# Altium schematic sheet IQ_Mod.SchDoc
size B; SheetNumber: 2; SheetTotal: 15
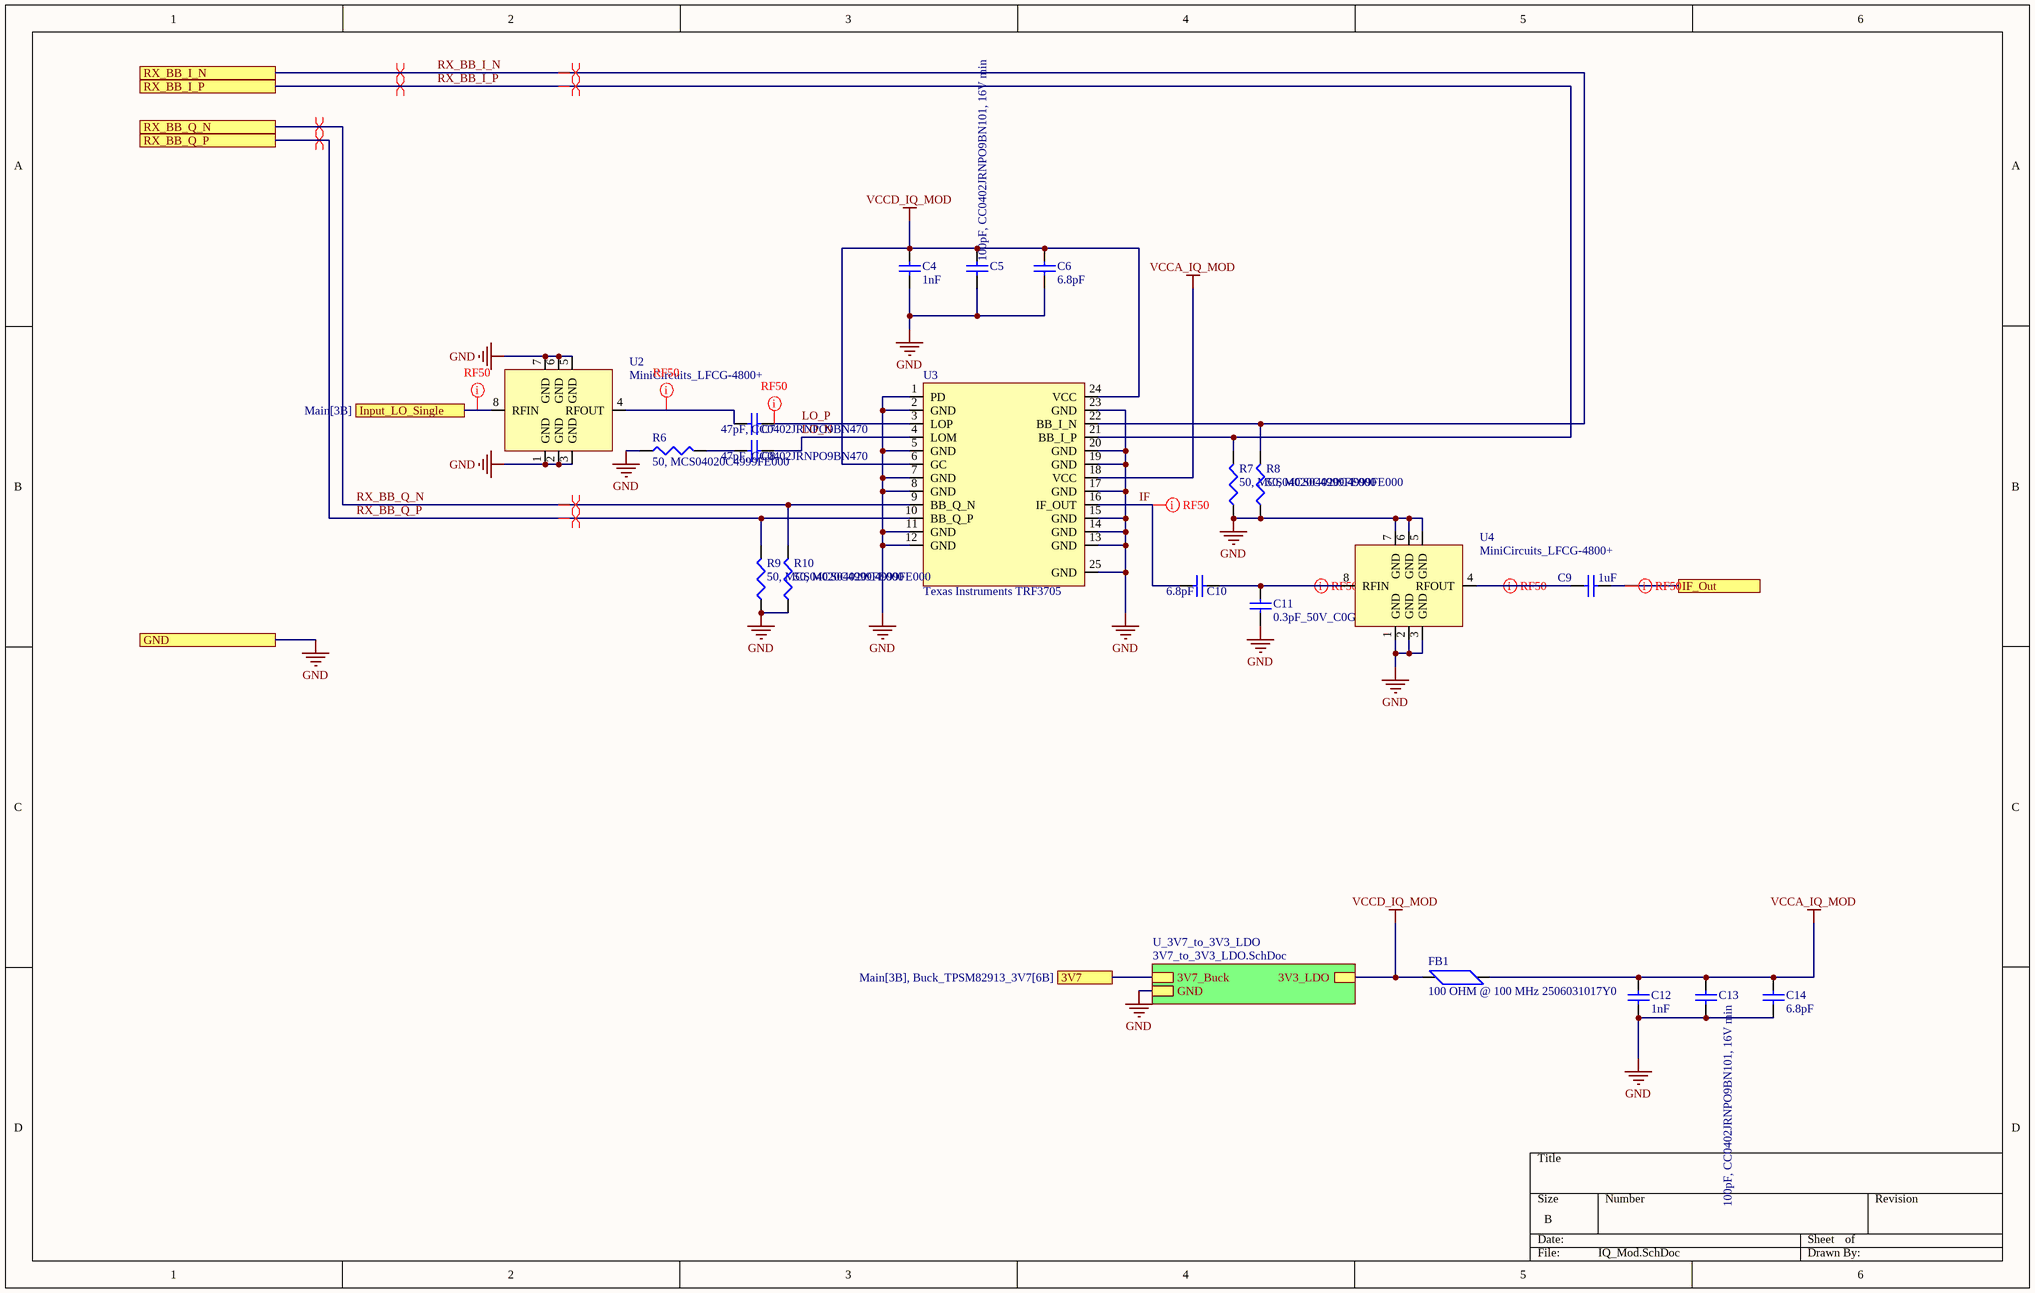
[diagram p0: IQ_Mod.SchDoc]

## Parts
C4  1nF  [SMD-0402]
C5  100pF, CC0402JRNPO9BN101, 16V min  [SMD-0402]
C6  6.8pF  [SMD-0402]
C7  47pF, CC0402JRNPO9BN470  [SMD-0402]
C8  47pF, CC0402JRNPO9BN470  [SMD-0402]
C9  1uF  [SMD-0402]
C10  6.8pF  [SMD-0402]
C11  0.3pF_50V_C0G  [SMD-0402]
C12  1nF  [SMD-0402]
C13  100pF, CC0402JRNPO9BN101, 16V min  [SMD-0402]
C14  6.8pF  [SMD-0402]
FB1  100 OHM @ 100 MHz 2506031017Y0  [SMD-0603]
R6  50, MCS04020C4999FE000  [SMD-0402]
R7  50, MCS04020C4999FE000  [SMD-0402]
R8  50, MCS04020C4999FE000  [SMD-0402]
R9  50, MCS04020C4999FE000  [SMD-0402]
R10  50, MCS04020C4999FE000  [SMD-0402]
U2  MiniCircuits_LFCG-4800+  [MiniCircuits LFCG-1400+]
U3  Texas Instruments TRF3705  [TI_RGE0024B]
U4  MiniCircuits_LFCG-4800+  [MiniCircuits LFCG-1400+]

## Sub-sheets
U_3V7_to_3V3_LDO = 3V7_to_3V3_LDO.SchDoc: 3V7_Buck, GND, 3V3_LDO

## Ports
3V7 (see Main[3B], Buck_TPSM82913_3V7[6B]), GND (see Main[3B], 3V7_to_3V3_LDO[1B], 5V5_to_5V0_LDO[1C], Buck_TPSM82913_1V8[3C], Buck_TPSM82913_3V7[3C], Buck_TPSM82913_5V0[3C], Buck_TPSM82913_5V5[2C], Clocking_and_LO[2A], Fan_Interfaces[2B], IQ_Demod[1C], LMX2820[4D], Microzed_Interfaces[1A], Power_Supply[6B], Voltage_Conv_Bidirectional[1B]), IF_Out (see Main[3A]), Input_LO_Single (see Main[3B]), RX_BB_I_N (see Main[3B]), RX_BB_I_P (see Main[3A]), RX_BB_Q_N (see Main[3B]), RX_BB_Q_P (see Main[3B])

## Nets
GND: C4.2 C5.2 C6.2 C11.2 C12.2 C13.2 C14.2 R6.1 R7.1 R8.1 R9.1 R10.1 U2.1(GND) U2.2(GND) U2.3(GND) U2.5(GND) U2.6(GND) U2.7(GND) U3.1(PD) U3.2(GND) U3.5(GND) U3.7(GND) U3.8(GND) U3.11(GND) U3.12(GND) U3.13(GND) U3.14(GND) U3.15(GND) U3.17(GND) U3.19(GND) U3.20(GND) U3.23(GND) U3.25(GND) U4.1(GND) U4.2(GND) U4.3(GND) U4.5(GND) U4.6(GND) U4.7(GND) ; port GND, sheet U_3V7_to_3V3_LDO/GND
VCCA_IQ_MOD: C12.1 C13.1 C14.1 FB1.1 U3.18(VCC)
VCCD_IQ_MOD: C4.1 C5.1 C6.1 FB1.2 U3.6(GC) U3.24(VCC) ; sheet U_3V7_to_3V3_LDO/3V3_LDO
3V7: port 3V7, sheet U_3V7_to_3V3_LDO/3V7_Buck
IF: C10.2 U3.16(IF_OUT)
IF_Out: C9.2 ; port IF_Out
Input_LO_Single: U2.8(RFIN) ; port Input_LO_Single
LO_N: C8.1 U3.4(LOM)
LO_P: C7.1 U3.3(LOP)
RX_BB_I_N: R8.2 U3.22(BB_I_N) ; port RX_BB_I_N
RX_BB_I_P: R7.2 U3.21(BB_I_P) ; port RX_BB_I_P
RX_BB_Q_N: R10.2 U3.9(BB_Q_N) ; port RX_BB_Q_N
RX_BB_Q_P: R9.2 U3.10(BB_Q_P) ; port RX_BB_Q_P
NetC7_2: C7.2 U2.4(RFOUT)
NetC8_2: C8.2 R6.2
NetC9_1: C9.1 U4.4(RFOUT)
NetC10_1: C10.1 C11.1 U4.8(RFIN)

## Layout directives
net class RF50: IF, IF_Out, Input_LO_Single, LO_P, NetC7_2, NetC9_1, NetC10_1
differential pair: RX_BB_I_N, RX_BB_I_P, RX_BB_Q_N, RX_BB_Q_P
net class DIFF_100: RX_BB_I_N, RX_BB_I_P, RX_BB_Q_N, RX_BB_Q_P

## Library data of the parts
C4-C14 = CAP0402: Ceramic Capacitor 0402
FB1 = FB0603: Ferrite Bead 0603
R6-R10 = RES0402: Resistor-0402
U2 U4 = MiniCircuits_LFCG-1400+